# Altium schematic sheet ESP32_Schematic.SchDoc
size 381 x 304 mm; SheetNumber: 1; SheetTotal: 1
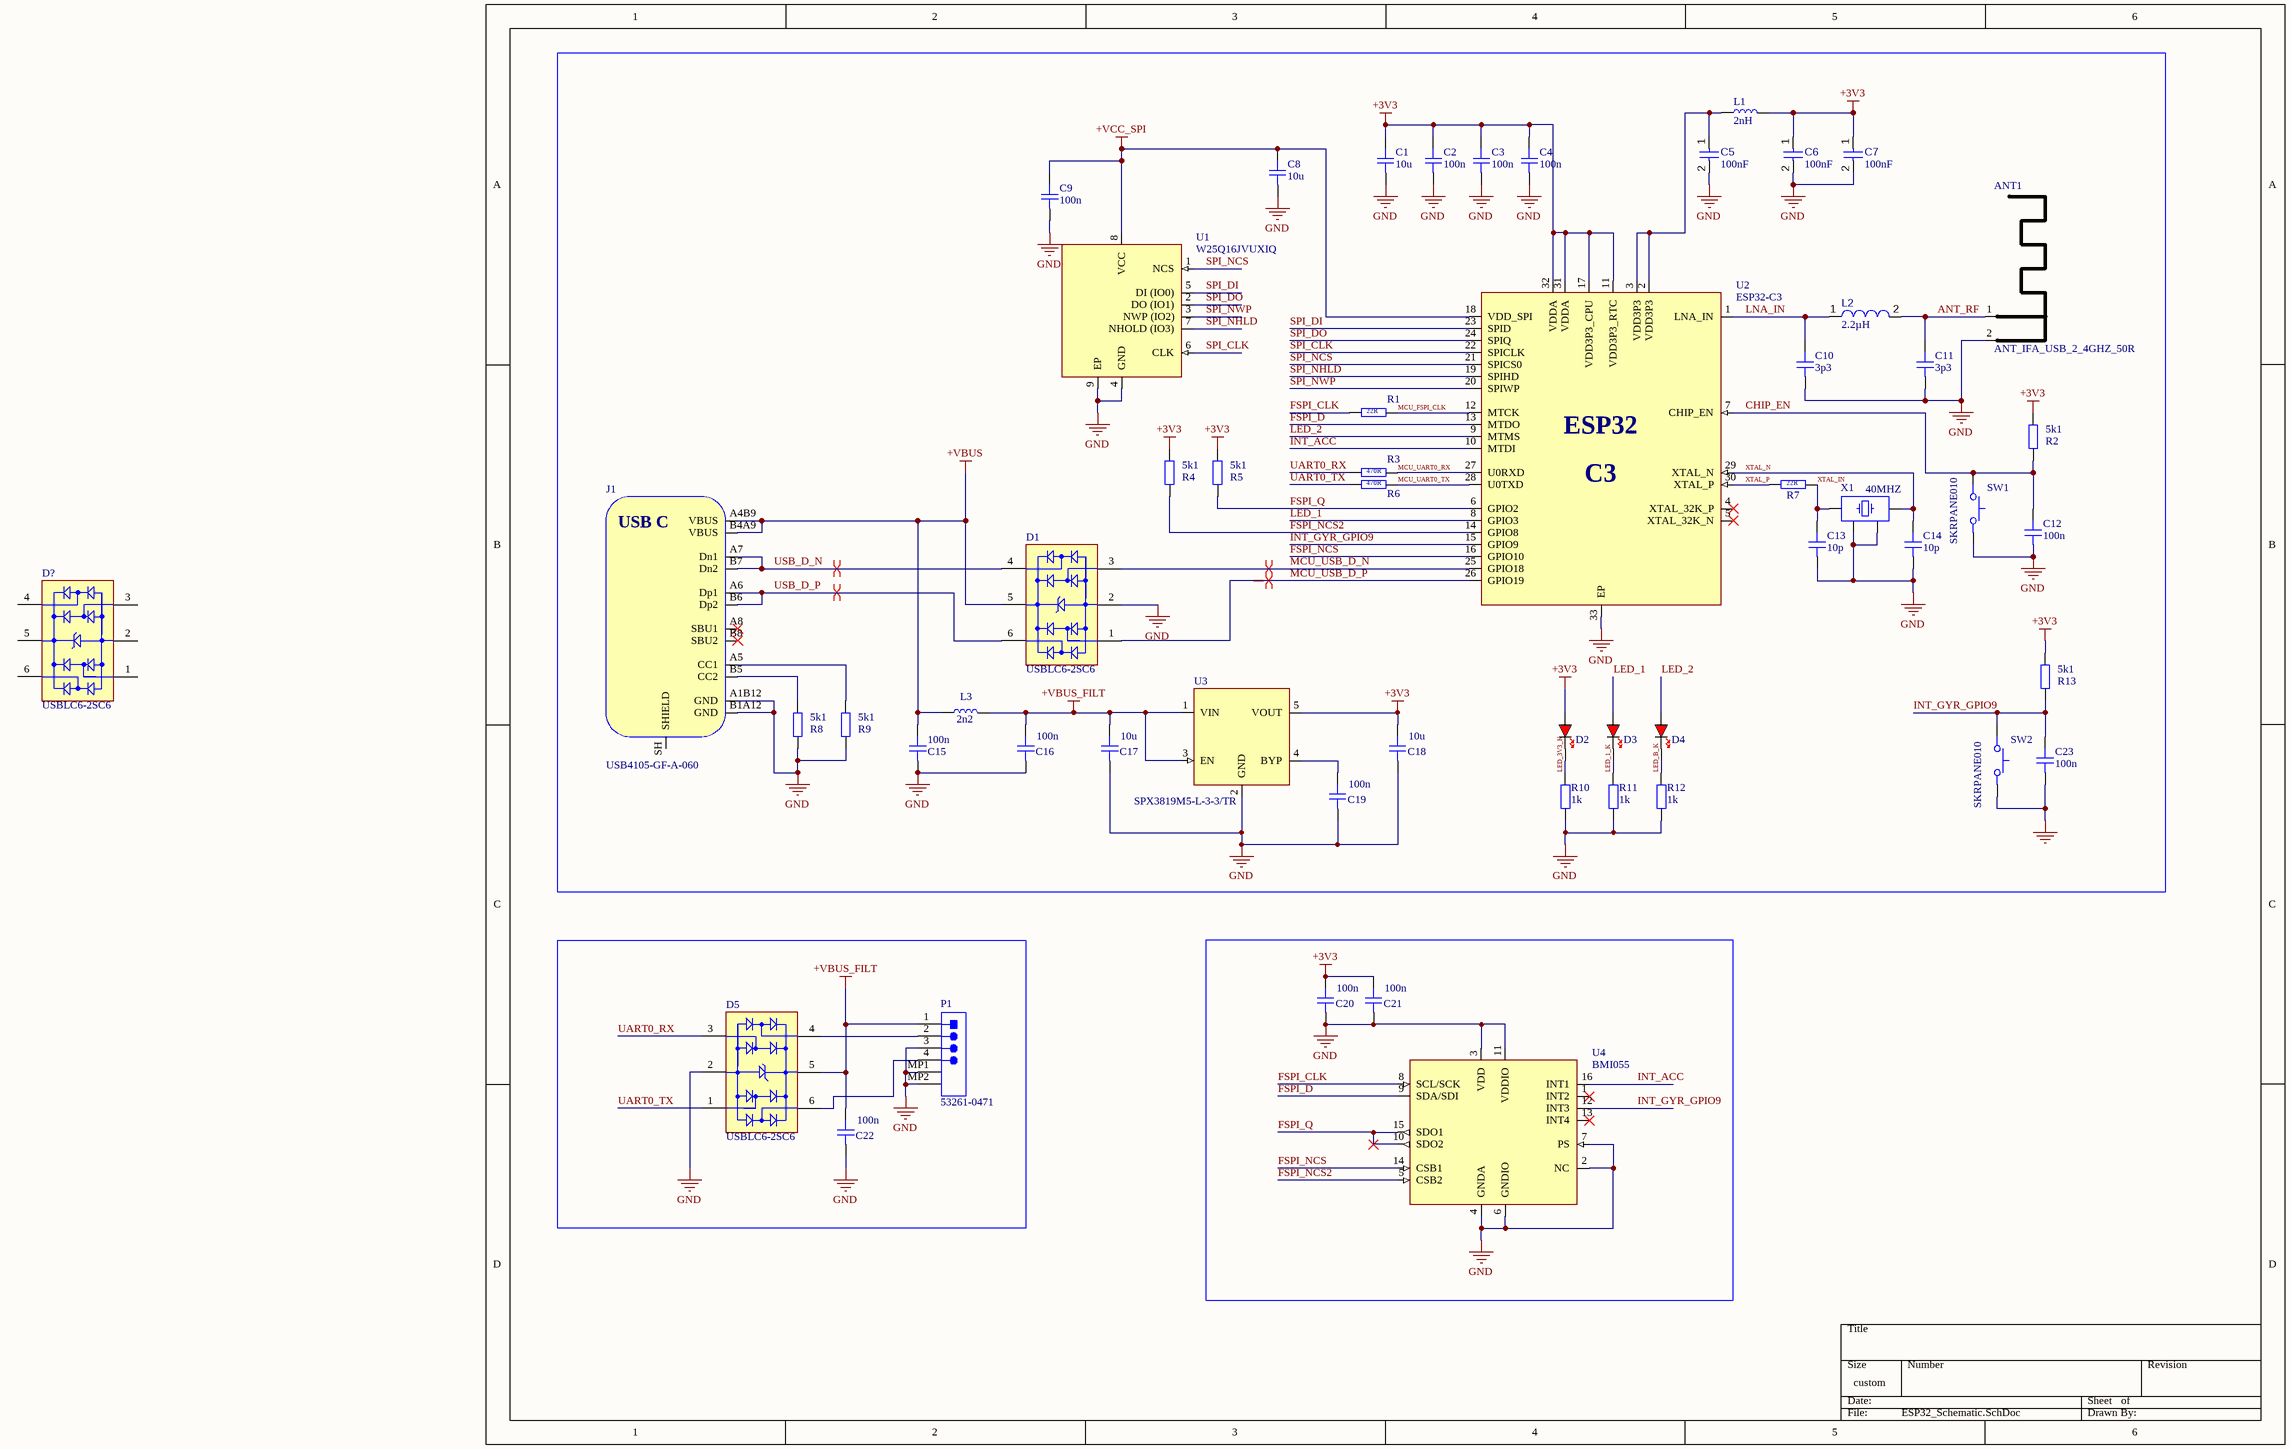
[diagram p0: ESP32_Schematic.SchDoc]

## Parts
ANT1  ANT_IFA_USB_2_4GHZ_50R  [ANT_IFA_USB_2_4GHZ_50R]  (no BOM)
C1  10u  [CAP_0402]
C2  100n  [CAP_0402]
C3  100n  [CAP_0402]
C4  100n  [CAP_0402]
C5  value 100nF  [CAPC1005X56X25LL10T15]  (hidden comment: Capacitor 0.1 uF +/- 5% 16 V 0402)
C6  value 100nF  [CAPC1005X56X25LL10T15]  (hidden comment: Capacitor 0.1 uF +/- 5% 16 V 0402)
C7  value 100nF  [CAPC1005X56X25LL10T15]  (hidden comment: 10u)
C8  10u  [CAP_0402]
C9  100n  [CAP_0402]
C10  3p3  [CAP_0402]
C11  3p3  [CAP_0402]
C12  100n  [CAP_0603]
C13  10p  [CAP_0402]
C14  10p  [CAP_0402]
C15  100n  [CAP_0603]
C16  100n  [CAP_0603]
C17  10u  [CAP_0603]
C18  10u  [CAP_0603]
C19  100n  [CAP_0603]
C20  100n  [CAP_0603]
C21  100n  [CAP_0603]
C22  100n  [CAP_0603]
C23  100n  [CAP_0603]
D1  USBLC6-2SC6  [STM-SOT23-6L_V]
D2  RED  [LED_0402_RED]  (value not drawn)
D3  RED  [LED_0402_RED]  (value not drawn)
D4  RED  [LED_0402_RED]  (value not drawn)
D5  USBLC6-2SC6  [STM-SOT23-6L_V]
D?  USBLC6-2SC6  [STM-SOT23-6L_V]
J1  USB4105-GF-A-060  [USB4105-GF-A-060]
L1  2nH  [IND_0402]
L2  value 2.2µH  [IND1005X55X20VL5T10]  (hidden comment: ELJ-RF2N2DFB)
L3  2n2  [IND_0603]
P1  53261-0471  [MOLEX-53261-0471_V]
R1  22R  [RES_0402]
R2  5k1  [RES_0603]
R3  470R  [RES_0402]
R4  5k1  [RES_0603]
R5  5k1  [RES_0603]
R6  470R  [RES_0402]
R7  22R  [RES_0402]
R8  5k1  [RES_0603]
R9  5k1  [RES_0603]
R10  1k  [RES_0402]
R11  1k  [RES_0402]
R12  1k  [RES_0402]
R13  5k1  [RES_0603]
SW1  SKRPANE010  [SKRPANE010]
SW2  SKRPANE010  [SKRPANE010]
U1  W25Q16JVUXIQ  [USON-8-2X3MM]
U2  ESP32-C3  [QFN32-5X5]
U3  SPX3819M5-L-3-3/TR  [SOT-23-5]
U4  BMI055  [BMI088]
X1  40MHZ  [XTAL_2520]

## Nets
+3V3: C1.2 C2.2 C3.2 C4.2 C6.1 C7.1 C18.2 C20.2 C21.2 D2.A L1.2 R2.2 R4.2 R5.2 R13.2 U2.11(VDD3P3_RTC) U2.17(VDD3P3_CPU) U2.31(VDDA) U2.32(VDDA) U3.5(VOUT)
+VBUS: C15.2 D1.5(VBUS) J1.A4B9(VBUS) J1.B4A9(VBUS) L3.1
+VBUS_FILT: C16.2 C17.2 C22.2 D5.5(VBUS) L3.2 P1.1 U3.1(VIN) U3.3(EN)
+VCC_SPI: C8.2 C9.2 U1.8(VCC) U2.18(VDD_SPI)
GND: ANT1.2(GND) C1.1 C2.1 C3.1 C4.1 C5.2 C6.2 C7.2 C8.1 C9.1 C10.1 C11.1 C12.1 C13.1 C14.1 C15.1 C16.1 C17.1 C18.1 C19.1 C20.1 C21.1 C22.1 C23.1 D1.2(GND) D5.2(GND) J1.A1B12(GND) J1.B1A12(GND) P1.3 P1.MP1 P1.MP2 R8.1 R9.1 R10.1 R11.1 R12.1 SW1.12 SW2.12 U1.4(GND) U1.9(EP) U2.33(EP) U3.2(GND) U4.2(NC) U4.3(VDD) U4.4(GNDA) U4.6(GNDIO) U4.7(PS) U4.11(VDDIO) X1.2 X1.4
ANT_RF: ANT1.1(RF) C11.2 L2.2
CHIP_EN: C12.2 R2.1 SW1.34 U2.7(CHIP_EN)
FSPI_CLK: R1.1 U4.8(SCL/SCK)
FSPI_D: U2.13(MTDO) U4.9(SDA/SDI)
FSPI_NCS: U2.16(GPIO10) U4.14(CSB1)
FSPI_NCS2: R4.1 U2.14(GPIO8) U4.5(CSB2)
FSPI_Q: R5.1 U2.6(GPIO2) U4.10(SDO2) U4.15(SDO1)
INT_ACC: U2.10(MTDI) U4.16(INT1)
INT_GYR_GPIO9: C23.2 R13.1 SW2.34 U2.15(GPIO9) U4.12(INT3)
LED_1: D3.A U2.8(GPIO3)
LED_1_K: D3.K R11.2
LED_2: D4.A U2.9(MTMS)
LED_3V3_K: D2.K R10.2
LED_B_K: D4.K R12.2
LNA_IN: C10.2 L2.1 U2.1(LNA_IN)
MCU_FSPI_CLK: R1.2 U2.12(MTCK)
MCU_UART0_RX: R3.2 U2.27(U0RXD)
MCU_UART0_TX: R6.2 U2.28(U0TXD)
MCU_USB_D_N: D1.3(I/O_2) U2.25(GPIO18)
MCU_USB_D_P: D1.1(I/O_1) U2.26(GPIO19)
SPI_CLK: U1.6(CLK) U2.22(SPICLK)
SPI_DI: U1.5(DI_(IO0)) U2.23(SPID)
SPI_DO: U1.2(DO_(IO1)) U2.24(SPIQ)
SPI_NCS: U1.1(NCS) U2.21(SPICS0)
SPI_NHLD: U1.7(NHOLD_(IO3)) U2.19(SPIHD)
SPI_NWP: U1.3(NWP_(IO2)) U2.20(SPIWP)
UART0_RX: D5.3(I/O_2) R3.1
UART0_TX: D5.1(I/O_1) R6.1
USB_D_N: D1.4(I/O_3) J1.A7(Dn1) J1.B7(Dn2)
USB_D_P: D1.6(I/O_4) J1.A6(Dp1) J1.B6(Dp2)
XTAL_IN: C13.2 R7.2 X1.1
XTAL_N: C14.2 U2.29(XTAL_N) X1.3
XTAL_P: R7.1 U2.30(XTAL_P)
NetC5_1: C5.1 L1.1 U2.2(VDD3P3) U2.3(VDD3P3)
NetC19_2: C19.2 U3.4(BYP)
NetD5_4: D5.4(I/O_3) P1.2
NetD5_6: D5.6(I/O_4) P1.4
NetJ1_A5: J1.A5(CC1) R9.2
NetJ1_B5: J1.B5(CC2) R8.2

Not connected (* = marked no-connect by the designer): D? 1(I/O_1) 2(GND) 3(I/O_2) 4(I/O_3) 5(VBUS) 6(I/O_4); J1 A8(SBU1)* B8(SBU2)* SH(SHIELD); U2 4(XTAL_32K_P)* 5(XTAL_32K_N)*; U4 1(INT2)* 13(INT4)*

## Layout directives
differential pair: MCU_USB_D_N, MCU_USB_D_P, USB_D_N, USB_D_P

## Notes on the sheet
- (in symbol CMP-002-00129-1) USB C
- (in symbol CMP-028-000024-1) ESP32; C3

## Library data of the parts
ANT1 = CMP-028-000142-1: Inverted F 2.4GHz ISM PCB Antenna 50 Ohm; Design Item ID: ANT_IFA_USB_2_4GHZ_50R; ComponentLink1URL: https://www.ti.com/lit/an/swra117d/swra117d.pdf; ComponentLink1Description: Datasheet; Source: Schematic-Lib-PhilsLab.SchLib
C1-C4 C8 C9 = CAP_0402_50V: Capacitor SMD 0402 50V; Manufacturer: Samsung; Manufacturer Part Number: CL05B104KO5NNNC; LCSC: C1525
C5-C7 = CMP-001-00001-6: Chip Capacitor, 0.1 uF, +/- 5%, 16 V, 0402 (1005 Metric); Capacitor Type: Ceramic; Voltage Rating: 16V; Max Operating Temperature: 125°C; Min Operating Temperature: -55°C; Case/Package: 0402; Mounting Technology: SM; Pins: 2; Tolerance: 5%; RoHS Compliant: True
C10 C11 C13 C14 = CAP_0402: Capacitor SMD 0402; Manufacturer: *; Manufacturer Part Number: *; Distributor Link: *; LCSC: *; Rating: *; Dielectric: *
C12 C23 = CAP_0603: Capacitor SMD 0603; Manufacturer: *; Manufacturer Part Number: *; Distributor Link: *; LCSC: *; Rating: *; Dielectric: *
C15-C22 = CMP-001-00087-1: Capacitor SMD 0603; Manufacturer Part Number: *; Distributor Link: *; Manufacturer: *; Rating: *; Design Item ID: CAP_0603; Source: Schematic-Lib-PhilsLab.SchLib; Dielectric: *; LCSC: *
D1 D5 D? = CMP-2000-05378-1: Very low capacitance ESD protection, 3.5 pF, -40 to 125 degC, 6-Pin SOT23, RoHS, Tape and Reel; Manufacturer: STMicroelectronics; Polarity: Uni-Directional; Clamping Voltage: 17V; Rad Hardened: No; Product Height (mm): 1.3mm; Leakage Current (Max): 0.15uA; Product Length (mm): 3.05mm; Number of Elements: 1; Peak Pulse Current: 5A; Configuration: Dual; Reverse Breakdown Voltage: 6V; Working Voltage (Max): 5V; Capacitance Value: 3.5pF; Suppressor Type: DiodeArrays; Product Depth (mm): 1.75mm; Test Current (It): 1mA; Package / Case: SOT-23; Operating Temperature Max Deg. C: 125C; Package Description: 6-Pin Small Outline Transistor, Body 2.925 x 1.625 mm, Pitch 0.95 mm; Package Reference: SOT23-6L; Datasheet Version: Rev. 5, 10/2011; Operating Temperature Min Deg. C: -40C; Mounting Style: SurfaceMount; Direction Type: Uni-Directional; Mounting: SurfaceMount; Pin Count: 6; Leakage Current: 0.15uA; Packaging: TapeandReel; Operating Temperature Classification: Automotive; Clamping Voltage (Max): 17V; Manufacturer URL: http://www.st.com/; Reverse Stand-off Voltage: 5V; Datasheet URL: http://www.st.com/st-web-ui/static/active/en/resource/technical/document/datasheet/CD00050750.pdf; Working Voltage: 5V; Operating Temp Range: -40Cto125C; LCSC: C7519
D2-D4 = LED_0402_RED: LED 0402 RED SMD
J1 = CMP-002-00129-1: USB Connector Type C SMT 12 Pin; Manufacturer: GCT; Distributor Link: https://eu.mouser.com/ProductDetail/GCT/USB4105-GF-A-060?qs=QNEnbhJQKvY2mocwNJzgfA%3D%3D; Source: Schematic-Lib-PhilsLab.SchLib; Manufacturer Part Number: USB4105-GF-A-060; Design Item ID: USB4105-GF-A-060
L1 = IND_0402: Inductor SMD 0402
L2 = CMP-006-00006-6: Chip Inductor, 2.2 nH, +/- 0.3 nH, 400 mA, -40 to 85 degC, 0402 (1005 Metric), RoHS, Tape and Reel; Manufacturer: Panasonic; Shielding: Unshielded; Current Rating: 400mA; Tolerance: 5%; Core Material: Ceramic; Q Factor: 8; Datasheet URL: http://www.bourns.com/docs/Product-Datasheets/cm322522.pdf; Case/Package: 0402; RoHS Compliant: True; Package Description: 2-Pin Surface Mount Device, Body 1 x 0.5 mm; Packaging: TapeandReel; Datasheet Version: Sep-12; Package Quantity: 10000; Package Reference: 0402; Min Operating Temperature: -20°C; Mounting Technology: SM; Max Operating Temperature: 85°C
L3 = CMP-006-00026-1: Inductor SMD 0603; Design Item ID: IND_0603; Source: Schematic-Lib-PhilsLab.SchLib
P1 = CMP-2000-05238-1: Male Header, Pitch 1.25 mm, 1 x 4 Position, Height 3.4 mm, -40 to 85 degC, RoHS, Tape and Reel; Current Rating: 1A; Brand: Molex; Number of Positions / Contacts: 4; Pitch: 1.25mm; Voltage Rating: 125V; Mounting Angle: Right; Manufacturer URL: http://www.molex.com/; Factory Pack Quantity: 1000; Housing Material: Thermoplastic; Datasheet URL: http://www.molex.com/pdm_docs/sd/532610471_sd.pdf; Tradename: PicoBlade; Product Type: Headers; Contact Plating: Tin; Contact Material: PhosphorBronze; Package Description: 1.25mm Pitch PicoBlade(TM) Header, Surface Mount, Right Angle, Lead-Free, 4 Circuits; Mounting Style: SMD/SMT; Manufacturer: Molex; Series: 53261; Packaging: Reel; Number of Rows: 1; RoHS: Details; Number of Positions: 4; Product Category: Headers&WireHousings; Datasheet Version: Rev. G, 01/2012; Type: Shrouded; Termination Style: SMD
R1 R3 R6 R7 = CMP-009-00182-1: Resistor SMD 0402; Distributor Link: *; Source: Schematic-Lib-PhilsLab.SchLib; Manufacturer Part Number: *; LCSC: *; Design Item ID: RES_0402; Manufacturer: *
R2 R4 R5 R8 R9 R13 = CMP-009-00183-1: Resistor SMD 0603; Manufacturer Part Number: *; Distributor Link: *; LCSC: *; Source: Schematic-Lib-PhilsLab.SchLib; Manufacturer: *; Design Item ID: RES_0603
R10-R12 = RES_0402: Resistor SMD 0402; Manufacturer: *; Manufacturer Part Number: *; Distributor Link: *; LCSC: *
SW1 = CMP-011-00019-1: Tactile Switch SMD SPST; Manufacturer: Alps Alpine; Manufacturer Part Number: SKRPANE010; Design Item ID: SKRPANE010; Source: Schematic-Lib-PhilsLab.SchLib
SW2 = SKRPANE010: Tactile Switch SMD SPST; Manufacturer: Alps Alpine; Manufacturer Part Number: SKRPANE010; LCSC: C470426
U1 = CMP-031-00020-1: 16M-BIT SERIAL FLASH MEMORY WITH DUAL/QUAD SPI USON-8; Manufacturer: Winbond; Design Item ID: W25Q16JVUXIQ; Source: Schematic-Lib-PhilsLab.SchLib; LCSC: C2843335; Manufacturer Part Number: W25Q16JVUXIQ
U2 = CMP-028-000024-1: Ultra­Low­Power SoC with RISC­V Single­Core CPU Supporting IEEE 802.11b/g/n (2.4 GHz Wi­Fi) and Bluetooth® 5 (LE); Manufacturer: Espressif; Source: Schematic-Lib-PhilsLab.SchLib; Manufacturer Part Number: ESP32-C3; Design Item ID: ESP32-C3; LCSC: C2838500
U3 = CMP-028-000131-1: 500mA +3.3V Low-Noise LDO Voltage Regulator; Manufacturer: MaxLinear; Source: Schematic-Lib-PhilsLab.SchLib; Design Item ID: SPX3819M5-L-3-3/TR; Manufacturer Part Number: SPX3819M5-L-3-3/TR
U4 = BMI055: Inertial Measurement Unit IMU 6-Axis LGA; Manufacturer: Bosch; Manufacturer Part Number: BMI055; LCSC: C189620
X1 = XTAL_2520: Crystal SMD 2520; Distributor Link: *